# Altium schematic sheet BaseBoardSch.SchDoc
size A4
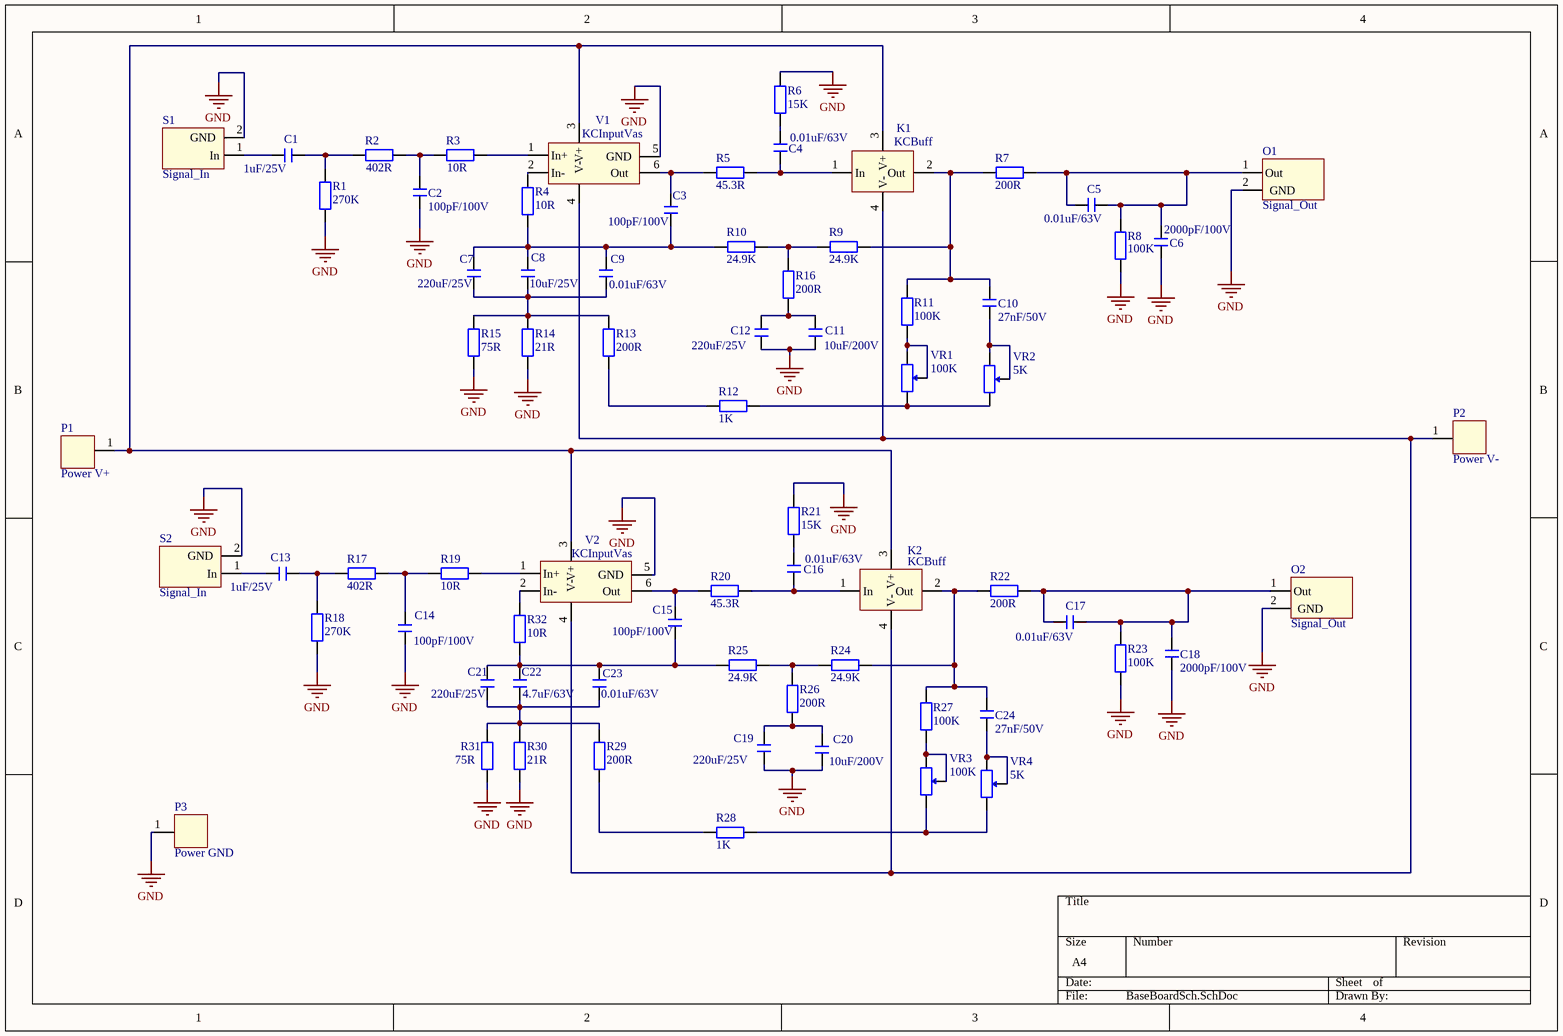
[diagram p0: BaseBoardSch.SchDoc]

## Parts
C1  1uF/25V  [CBB 20*23*17]
C2  100pF/100V  [CBB 20*23*17]
C3  100pF/100V  [CBB 10*12*8]
C4  0.01uF/63V  [CBB 10*12*8]
C5  0.01uF/63V  [CBB 10*12*8]
C6  2000pF/100V  [CBB 10*12*8]
C7  220uF/25V  [CBB 10*12*8]
C8  10uF/25V  [CBB 10*12*8]
C9  0.01uF/63V  [CBB 10*12*8]
C10  27nF/50V  [CBB 10*12*8]
C11  10uF/200V  [CBB 10*12*8]
C12  220uF/25V  [CBB 10*12*8]
C13  1uF/25V  [CBB 10*12*8]
C14  100pF/100V  [CBB 10*12*8]
C15  100pF/100V  [CBB 10*12*8]
C16  0.01uF/63V  [CBB 10*12*8]
C17  0.01uF/63V  [CBB 10*12*8]
C18  2000pF/100V  [CBB 10*12*8]
C19  220uF/25V  [CBB 10*12*8]
C20  10uF/200V  [CBB 10*12*8]
C21  220uF/25V  [CBB 10*12*8]
C22  4.7uF/63V  [CBB 10*12*8]
C23  0.01uF/63V  [CBB 10*12*8]
C24  27nF/50V  [CBB 10*12*8]
K1  KCBuff  [KCBuff]
K2  KCBuff  [KCBuff]
O1  Signal_Out  [Signal_Terminal]
O2  Signal_Out  [Signal_Terminal]
P1  Power V+  [SinglePin]
P2  Power V-  [SinglePin]
P3  Power GND  [SinglePin]
R1  270K  [RS 1/4W]
R2  402R  [RS 1/4W]
R3  10R  [RS 1/4W]
R4  10R  [RS 1/4W]
R5  45.3R  [RS 1/4W]
R6  15K  [RS 1/4W]
R7  200R  [RS 1/4W]
R8  100K  [RS 1/4W]
R9  24.9K  [RS 1/4W]
R10  24.9K  [RS 1/4W]
R11  100K  [RS 1/4W]
R12  1K  [RS 1/4W]
R13  200R  [RS 1/4W]
R14  21R  [RS 1/4W]
R15  75R  [RS 1/4W]
R16  200R  [RS 1/4W]
R17  402R  [RS 1/4W]
R18  270K  [RS 1/4W]
R19  10R  [RS 1/4W]
R20  45.3R  [RS 1/4W]
R21  15K  [RS 1/4W]
R22  200R  [RS 1/4W]
R23  100K  [RS 1/4W]
R24  24.9K  [RS 1/4W]
R25  24.9K  [RS 1/4W]
R26  200R  [RS 1/4W]
R27  100K  [RS 1/4W]
R28  1K  [RS 1/4W]
R29  200R  [RS 1/4W]
R30  21R  [RS 1/4W]
R31  75R  [RS 1/4W]
R32  10R  [RS 1/4W]
S1  Signal_In  [Signal_Terminal]
S2  Signal_In  [Signal_Terminal]
V1  KCInputVas  [KCIn_VAS]
V2  KCInputVas  [KCIn_VAS]
VR1  100K  [RS 1/2W-VR]
VR2  5K  [RS 1/2W-VR]
VR3  100K  [RS 1/2W-VR]
VR4  5K  [RS 1/2W-VR]

## Nets
GND: C2.1 C6.1 C11.1 C12.1 C14.1 C18.2 C19.2 C20.2 O1.2(GND) O2.2(GND) P3.1 R1.1 R6.1 R8.1 R14.1 R15.1 R18.1 R21.2 R23.2 R30.1 R31.1 S1.2(GND) S2.2(GND) V1.5(GND) V2.5(GND)
NetC1_1: C1.1 S1.1(In)
NetC1_2: C1.2 R1.2 R2.1
NetC2_2: C2.2 R2.2 R3.2
NetC3_1: C3.1 C7.2 C8.2 C9.2 R4.1 R10.2
NetC3_2: C3.2 R5.2 V1.6(Out)
NetC4_1: C4.1 K1.1(In) R5.1
NetC4_2: C4.2 R6.2
NetC5_1: C5.1 C5.2 C6.2 O1.1(Out) R7.2 R8.2
NetC7_1: C7.1 C8.1 C9.1 R13.2 R14.2 R15.2
NetC10_1: C10.1 VR2.1 VR2.3
NetC10_2: C10.2 K1.2(Out) R7.1 R9.1 R11.1
NetC11_2: C11.2 C12.2 R16.1
NetC13_1: C13.1 S2.1(In)
NetC13_2: C13.2 R17.1 R18.2
NetC14_2: C14.2 R17.2 R19.1
NetC15_1: C15.1 C21.1 C22.1 C23.1 R25.1 R32.1
NetC15_2: C15.2 R20.1 V2.6(Out)
NetC16_1: C16.1 K2.1(In) R20.2
NetC16_2: C16.2 R21.1
NetC17_1: C17.1 C17.2 C18.1 O2.1(Out) R22.1 R23.1
NetC19_1: C19.1 C20.1 R26.1
NetC21_2: C21.2 C22.2 C23.2 R29.2 R30.2 R31.2
NetC24_1: C24.1 K2.2(Out) R22.2 R24.2 R27.1
NetC24_2: C24.2 VR4.1 VR4.3
NetK1_3: K1.3(V+) K2.3(V+) P1.1 V1.3(V+) V2.3(V+)
NetK1_4: K1.4(V-) K2.4(V-) P2.1 V1.4(V-) V2.4(V-)
NetR3_1: R3.1 V1.1(In+)
NetR4_2: R4.2 V1.2(In-)
NetR9_2: R9.2 R10.1 R16.2
NetR11_2: R11.2 VR1.1 VR1.3
NetR12_1: R12.1 R13.1
NetR12_2: R12.2 VR1.2 VR2.2
NetR19_2: R19.2 V2.1(In+)
NetR24_1: R24.1 R25.2 R26.2
NetR27_2: R27.2 VR3.1 VR3.3
NetR28_1: R28.1 R29.1
NetR28_2: R28.2 VR3.2 VR4.2
NetR32_2: R32.2 V2.2(In-)

## Library data of the parts
C1-C24 = C-CBB: CBB电容; 版权归属: 源创客; BOM名称: CBB电容; 学习资源: www.ooocke.com
K1 K2 = KCBuff: King Cello Buffer Stage
O1 O2 = Signal_Out: Signal Out
P1 P2 = PowerPin: Power Pin
P3 = PowerPin
R1-R32 = R-CRR: 直插色环电阻; BOM名称: 色环电阻; 版权归属: 源创客; 学习资源: www.ooocke.com
S1 S2 = Signal_In: Signal In
V1 V2 = KCInputVas: King Cello Input Stage and VAS
VR1-VR4 = VR-W: 直插可调电阻-顶调